# Altium schematic sheet STM32F103_top_v0.0.SchDoc
size A4
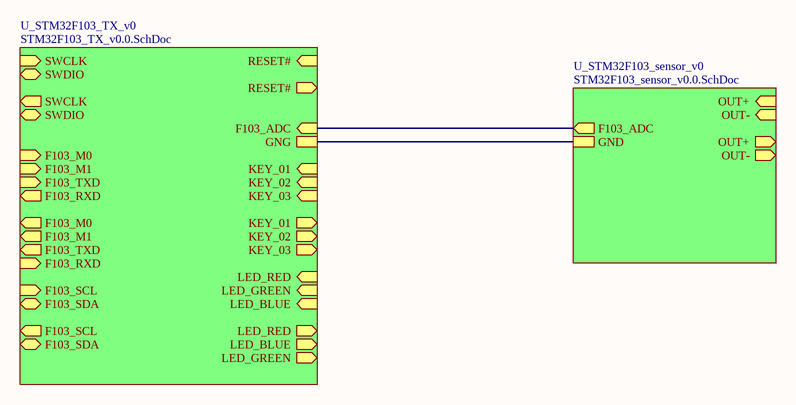
[diagram p0: STM32F103_top_v0.0.SchDoc]

## Sub-sheets
U_STM32F103_sensor_v0 = STM32F103_sensor_v0.0.SchDoc: OUT+ (out), OUT- (out), OUT+ (in), OUT- (in), F103_ADC (out), GND
U_STM32F103_TX_v0 = STM32F103_TX_v0.0.SchDoc: F103_M1 (out), F103_M0 (out), F103_TXD (out), F103_RXD (in), F103_SCL (out), F103_SDA (bidir), LED_BLUE (out), LED_RED (out), LED_GREEN (out), KEY_01 (in), KEY_02 (in), KEY_03 (in), F103_ADC (in), RESET# (in), F103_M0 (in), F103_M1 (in), F103_TXD (in), F103_RXD (out), F103_SCL (in), F103_SDA (bidir), RESET# (out), KEY_01 (out), KEY_02 (out), KEY_03 (out), LED_BLUE (in), LED_RED (in), LED_GREEN (in), SWCLK (out), SWDIO (bidir), SWCLK (in), SWDIO (bidir), GNG

## Nets
(unnamed): sheet U_STM32F103_sensor_v0/F103_ADC, sheet U_STM32F103_TX_v0/F103_ADC
(unnamed): sheet U_STM32F103_sensor_v0/GND, sheet U_STM32F103_TX_v0/GNG